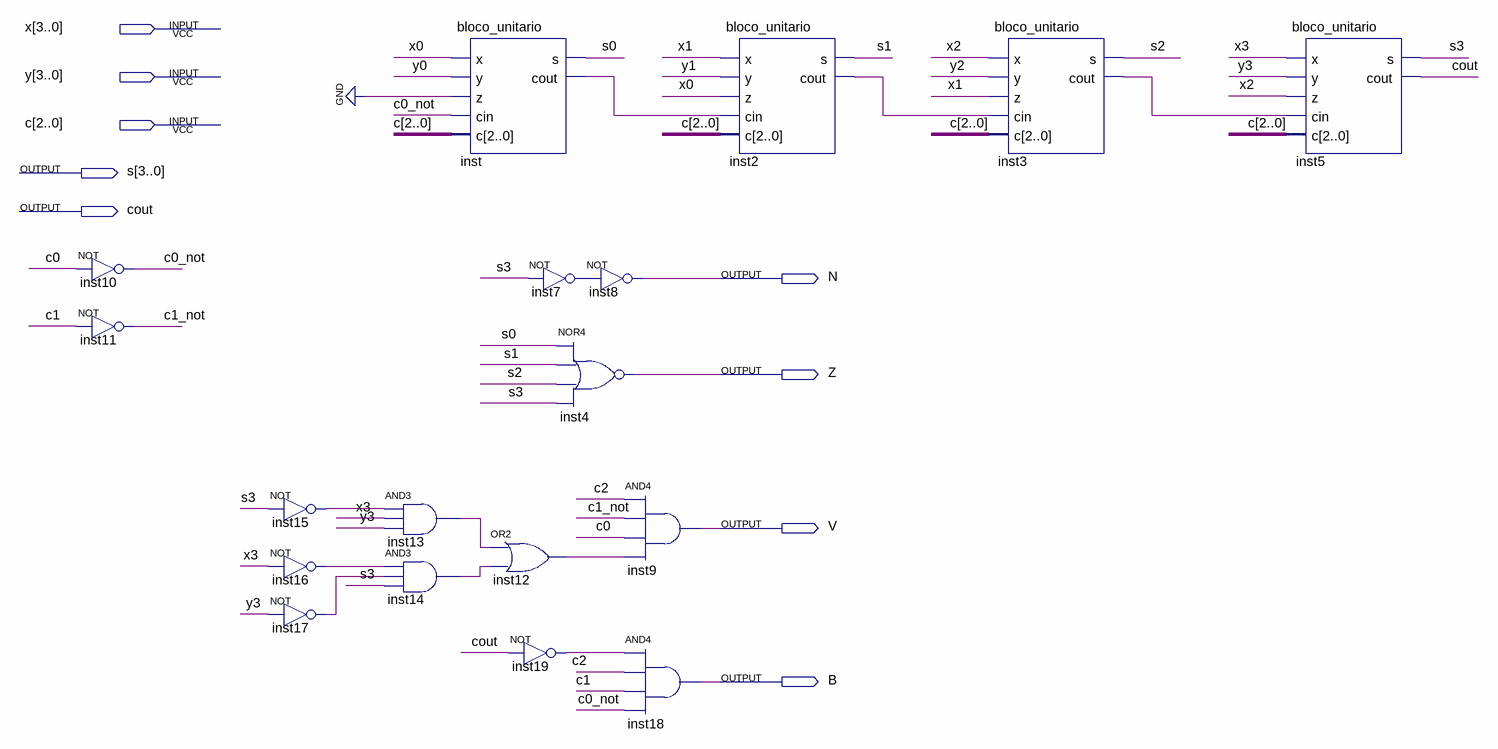
[diagram p0: schematic sheet]
// Quartus schematic ULA.bdf as structural Verilog: 18 symbols, 9 pins
module ULA (
  input  [3:0] x,
  input  [3:0] y,
  input  [2:0] c,
  output [3:0] s,
  output cout,
  output N,
  output Z,
  output V,
  output B
);

  wire c0_not, c1_not, inst2_cout, inst3_cout, inst7_out, inst12_out, inst13_out, inst14_out, inst15_out,
       inst16_out, inst17_out, inst19_out, inst_cout;

  not inst10 (c0_not, c[0]);
  not inst11 (c1_not, c[1]);
  not inst15 (inst15_out, s[3]);
  not inst16 (inst16_out, x[3]);
  not inst17 (inst17_out, y[3]);
  and inst13 (inst13_out, inst15_out, x[3], y[3]);
  and inst14 (inst14_out, inst16_out, inst17_out, s[3]);
  bloco_unitario inst (.x(x[0]), .y(y[0]), .z(1'b0), .cin(c0_not), .c(c), .s(s[0]), .cout(inst_cout));
  or inst12 (inst12_out, inst13_out, inst14_out);
  not inst7 (inst7_out, s[3]);
  nor inst4 (Z, s[0], s[1], s[2], s[3]);
  not inst19 (inst19_out, cout);
  not inst8 (N, inst7_out);
  and inst9 (V, c[2], c1_not, c[0], inst12_out);
  and inst18 (B, inst19_out, c[2], c[1], c0_not);
  bloco_unitario inst2 (.x(x[1]), .y(y[1]), .z(x[0]), .cin(inst_cout), .c(c), .s(s[1]), .cout(inst2_cout));
  bloco_unitario inst3 (.x(x[2]), .y(y[2]), .z(x[1]), .cin(inst2_cout), .c(c), .s(s[2]), .cout(inst3_cout));
  bloco_unitario inst5 (.x(x[3]), .y(y[3]), .z(x[2]), .cin(inst3_cout), .c(c), .s(s[3]), .cout(cout));
endmodule
